# EAGLE schematic datalogger-v20 (EAGLE 7.7.0)
DATABASE: /Users/kina/Documents/eagle/PARTSDB.txt

## Sheet 1 of 2
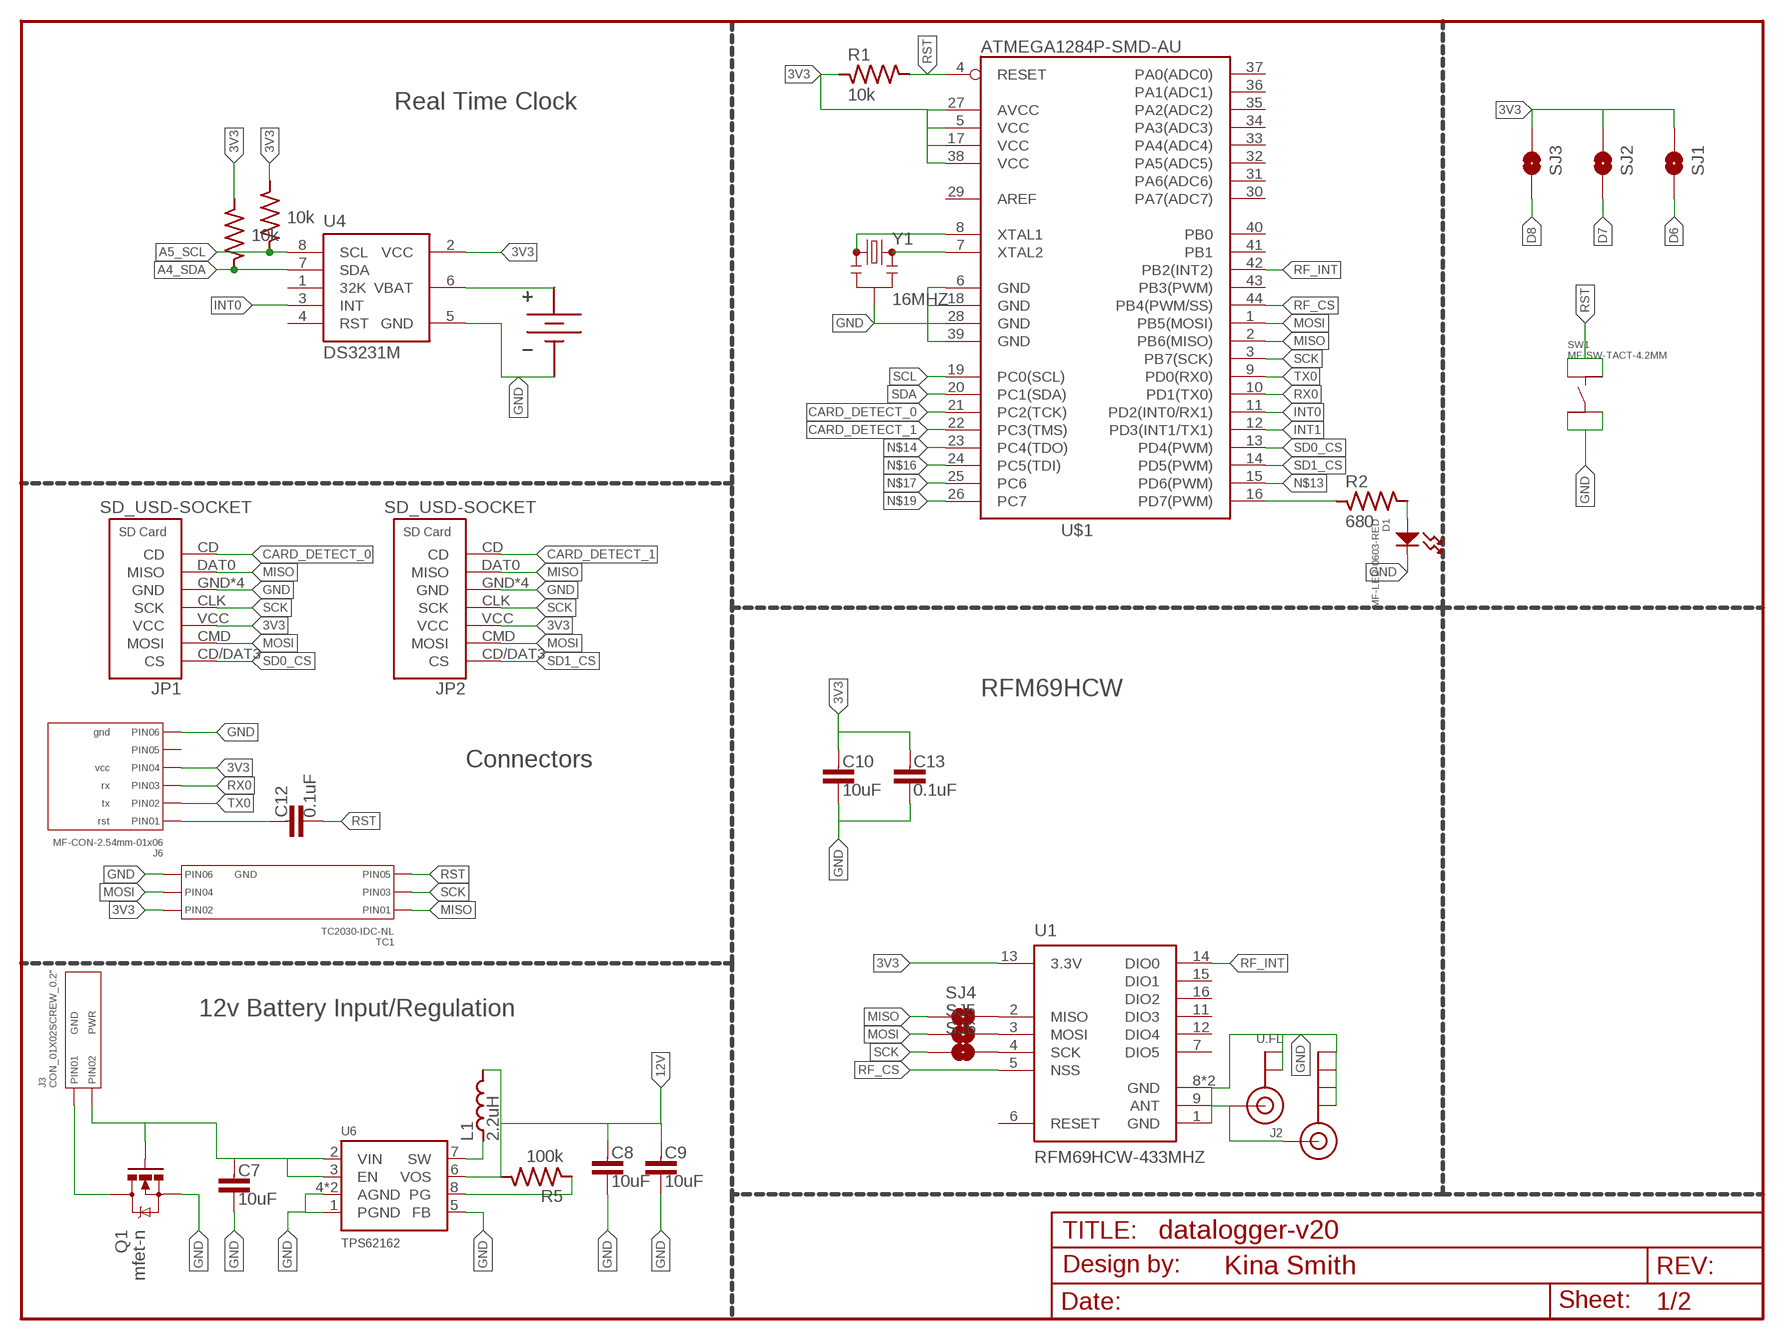
[diagram p0: schematic, sheet 1]

### Parts
BAT1  BATTERY_HOLDER12MM  [BAT_12MM]
C7  10uF  CAPACITOR_NP0805-N  [C0805-N]
C8  10uF  CAPACITOR_NP0805-N  [C0805-N]
C9  10uF  CAPACITOR_NP0805-N  [C0805-N]
C10  10uF  CAPACITOR_NP0805-N  [C0805-N]
C12  0.1uF  CAPACITOR_NP0603-N  [C0603-N]
C13  0.1uF  CAPACITOR_NP0603-N  [C0603-N]
D1  MF-LED-0603-RED  LED_SINGLE-0603-RED  [LED0603]
FRAME1  FRAME-LETTERNO_PACKAGE  [DUMMY]
J2  U.FL  ANTENNA_U.FL  [ADAFRUIT_U.FL]
J3  CON_01X02SCREW_0.2"  [SCREW_TERM_2POS]
J4  ANTENNA_SMA_EDGE  [SMA-EDGE]
J6  MF-CON-2.54mm-01x06  CON_01X06_PTH_2.54MM  [PTH_2.54MM_01X06]
JP1  SD_USD-SOCKET  [MICRO-SD-SOCKET-SDIO]
JP2  SD_USD-SOCKET  [MICRO-SD-SOCKET-SDIO]
L1  2.2uH  INDUCTOR2520  [L2520]
Q1  mfet-n  MOSFET-NCHANNELSOT23-3  [SOT23-3]
R1  10k  RESISTOR0603-N  [R0603-N]
R2  680  RESISTOR0603-N  [R0603-N]
R3  10k  RESISTOR0603-N  [R0603-N]
R4  10k  RESISTOR0603-N  [R0603-N]
R5  100k  RESISTOR0603-N  [R0603-N]
SJ1  JUMPER-PAD-2-NOYES_SILK  [PAD-JUMPER-2-NO_YES_SILK]
SJ2  JUMPER-PAD-2-NOYES_SILK  [PAD-JUMPER-2-NO_YES_SILK]
SJ3  JUMPER-PAD-2-NOYES_SILK  [PAD-JUMPER-2-NO_YES_SILK]
SJ4  JUMPER-PAD-2-NOYES_SILK  [PAD-JUMPER-2-NO_YES_SILK]
SJ5  JUMPER-PAD-2-NOYES_SILK  [PAD-JUMPER-2-NO_YES_SILK]
SJ6  JUMPER-PAD-2-NOYES_SILK  [PAD-JUMPER-2-NO_YES_SILK]
SW1  MF-SW-TACT-4.2MM  TACT_4.2MM  [TACT4.2MM]
TC1  TC2030-IDC-NL  CON_02X03_AVRISP_TC2030-IDC-NL  [TC2030-IDC-NL]
U1  RFM69HCW-433MHZ  [RFM69HCW-XXXS2]
U4  DS3231M  [SO08]
U6  TPS62162  [WSON-8]
U$1  ATMEGA1284P-SMD-AU  [TQFP44]
Y1  16MHZ  RESONATOR16MHZ  [RESONATOR-SMD]

### Nets
3V3: C10.1 C13.1 J6.P$4(PIN4) JP1.VCC JP2.VCC R1.1 R3.2 R4.2 SJ1.1 SJ2.1 SJ3.1 TC1.P$2(PIN2) U1.13(3.3V) U4.2(VCC) U$1.5(VCC) U$1.17(VCC) U$1.27(AVCC) U$1.38(VCC)
12V: C8.1 C9.1 L1.P$2 R5.2 U6.6(VOS)
A4_SDA: R4.1 U4.7(SDA)
A5_SCL: R3.1 U4.8(SCL)
ANT: J2.3(SIGNAL) J4.SIG(SIGNAL) U1.9(ANT)
CARD_DETECT_0: JP1.CD U$1.21(PC2(TCK))
CARD_DETECT_1: JP2.CD U$1.22(PC3(TMS))
D6: SJ1.2
D7: SJ2.2
D8: SJ3.2
GND [power]: BAT1.GND C7.2 C8.2 C9.2 C10.2 C13.2 D1.CATHODE J2.1(GND) J2.2(GND) J4.GND@0(GND) J4.GND@1(GND) J4.GND@2(GND) J4.GND@3(GND) J6.P$6(PIN6) JP1.GND JP1.GND1(GND) JP1.GND2(GND) JP1.GND3(GND) JP2.GND JP2.GND1(GND) JP2.GND2(GND) JP2.GND3(GND) Q1.2(S) SW1.P$3 SW1.P$4 TC1.P$6(PIN6) U1.1(GND) U1.8(GND) U1.10(GND) U4.5(GND) U6.1(PGND) U6.4(AGND) U6.5(FB) U6.P$9(AGND) U$1.6(GND) U$1.18(GND) U$1.28(GND) U$1.39(GND) Y1.2
INT0: U4.3(INT) U$1.11(PD2(INT0/RX1))
INT1: U$1.12(PD3(INT1/TX1))
MISO: JP1.DAT0(MISO) JP2.DAT0(MISO) SJ4.1 TC1.P$1(PIN1) U$1.2(PB6(MISO))
MOSI: JP1.CMD(MOSI) JP2.CMD(MOSI) SJ5.1 TC1.P$4(PIN4) U$1.1(PB5(MOSI))
N$1: J3.GND(PIN1) Q1.3(D)
N$2: R2.1 U$1.16(PD7(PWM))
N$3: U$1.7(XTAL2) Y1.3
N$4: C12.1 J6.P$1(PIN1)
N$5: U$1.8(XTAL1) Y1.1
N$6: L1.P$1 U6.7(SW)
N$7: SJ4.2 U1.2(MISO)
N$8: D1.ANODE R2.2
N$9: SJ5.2 U1.3(MOSI)
N$10: BAT1.PWR@1(VBAT) BAT1.PWR@2(VBAT) U4.6(VBAT)
N$13: U$1.15(PD6(PWM))
N$14: U$1.23(PC4(TDO))
N$15: SJ6.2 U1.4(SCK)
N$16: U$1.24(PC5(TDI))
N$17: U$1.25(PC6)
N$18: R5.1 U6.8(PG)
N$19: U$1.26(PC7)
RF_CS: U1.5(NSS) U$1.44(PB4(PWM/SS))
RF_INT: U1.14(DIO0) U$1.42(PB2(INT2))
RST: C12.2 R1.2 SW1.P$1 SW1.P$2 TC1.P$5(PIN5) U$1.4(RESET)
RX0: J6.P$3(PIN3) U$1.10(PD1(TX0))
SCK: JP1.CLK(SCK) JP2.CLK(SCK) SJ6.1 TC1.P$3(PIN3) U$1.3(PB7(SCK))
SCL: U$1.19(PC0(SCL))
SD0_CS: JP1.CD/DAT3(CS) U$1.13(PD4(PWM))
SD1_CS: JP2.CD/DAT3(CS) U$1.14(PD5(PWM))
SDA: U$1.20(PC1(SDA))
TX0: J6.P$2(PIN2) U$1.9(PD0(RX0))
V_BAT: C7.1 J3.PWR(PIN2) Q1.1(G) U6.2(VIN) U6.3(EN)
Unconnected: J6.P$5(PIN5) U1.6(RESET) U1.7(DIO5) U1.11(DIO3) U1.12(DIO4) U1.15(DIO1) U1.16(DIO2) U4.1(32K) U4.4(RST) U$1.29(AREF) U$1.30(PA7(ADC7)) U$1.31(PA6(ADC6)) U$1.32(PA5(ADC5)) U$1.33(PA4(ADC4)) U$1.34(PA3(ADC3)) U$1.35(PA2(ADC2)) U$1.36(PA1(ADC1)) U$1.37(PA0(ADC0)) U$1.40(PB0) U$1.41(PB1) U$1.43(PB3(PWM))

### Notes on the sheet
- Real Time Clock
- RFM69HCW
- Connectors
- 12v Battery Input/Regulation

## Sheet 2 of 2
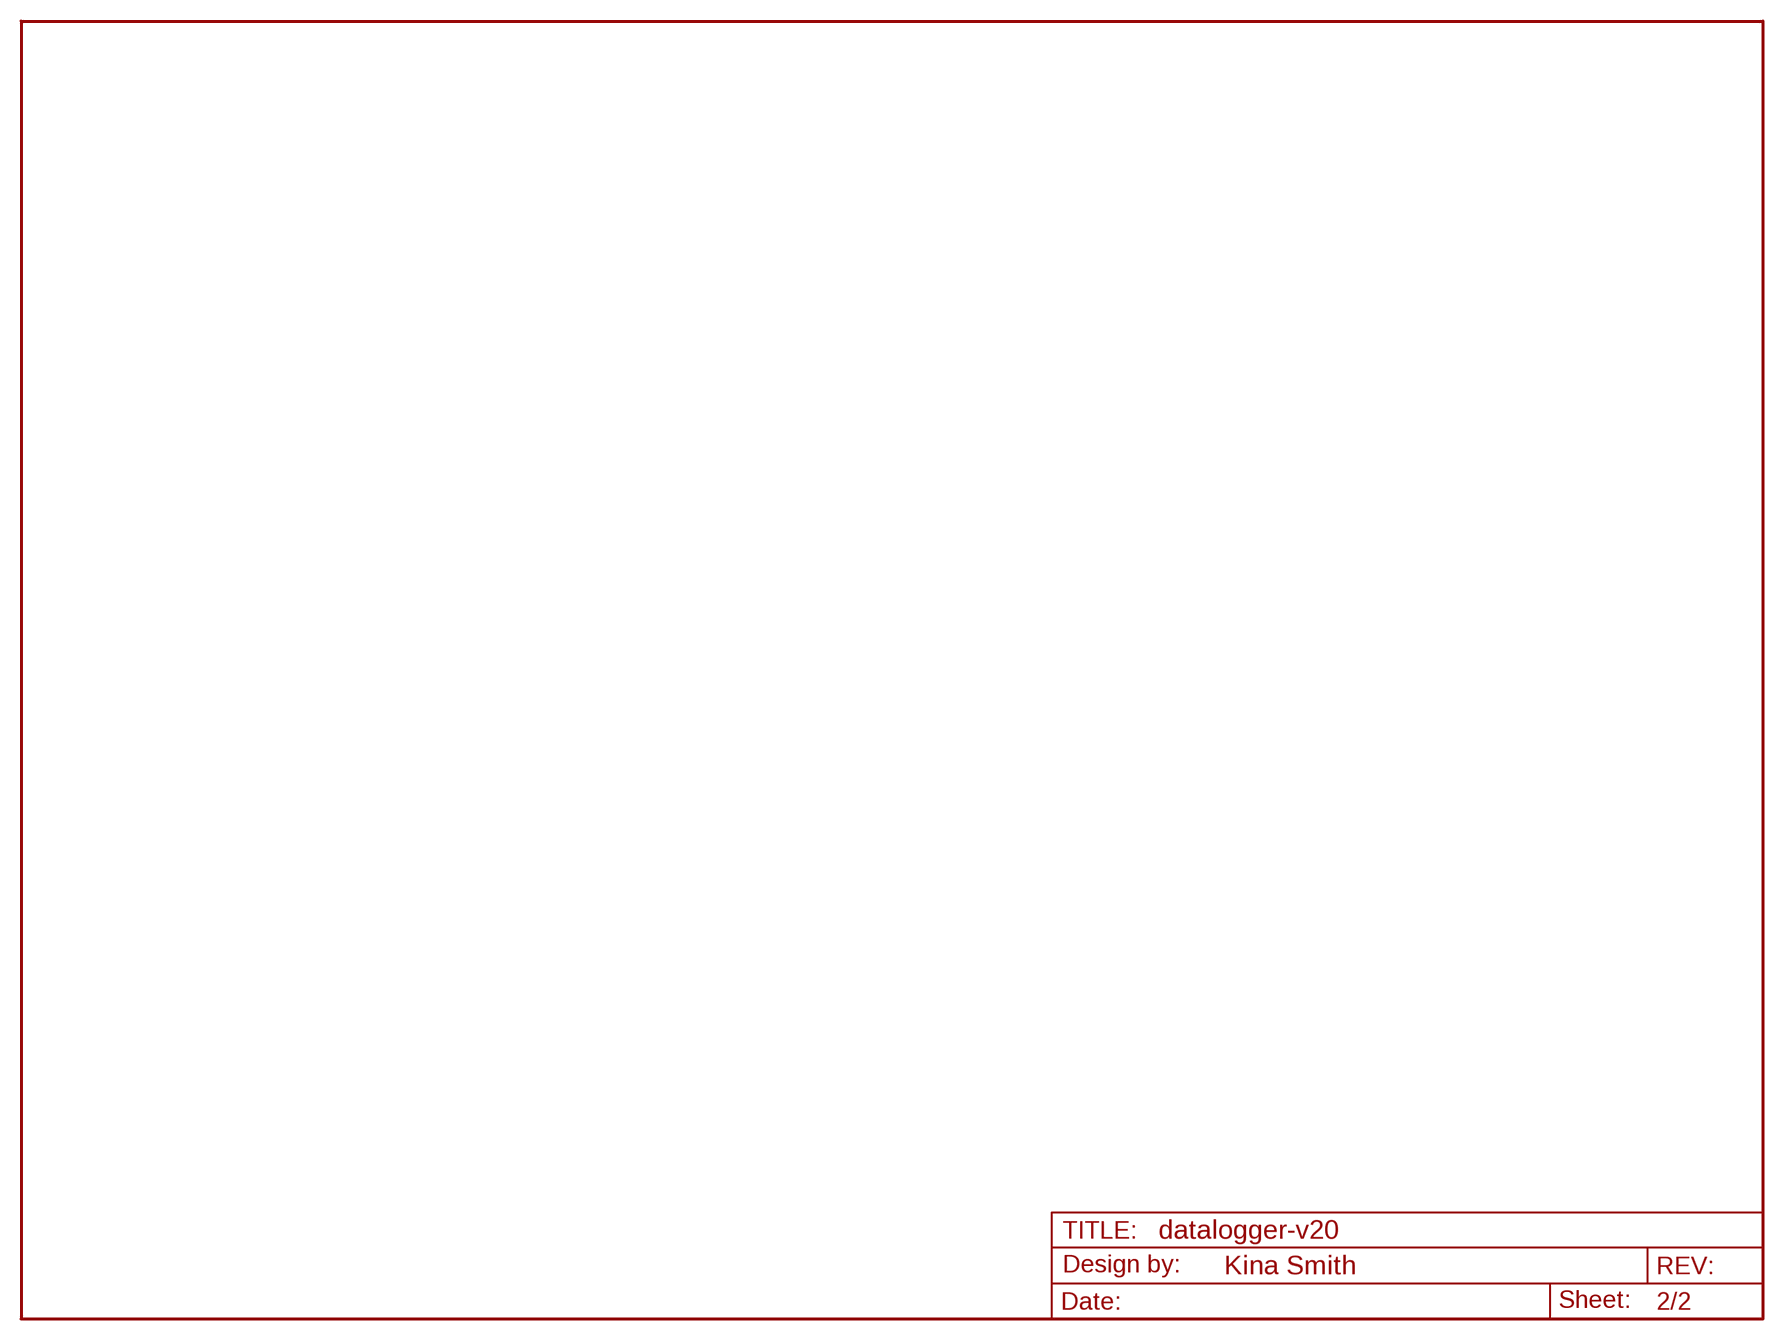
[diagram p1: schematic, sheet 2]

### Parts
FRAME3  FRAME-LETTERNO_PACKAGE  [DUMMY]

## Library data of the parts
BAT1 = My_Connectors:BATTERY_HOLDER; PARTNO: BK-885-TR
C7-C10 = My_Passives:CAPACITOR_NP; PARTNO: GRM21BR61C106KE15L
C12 C13 = My_Passives:CAPACITOR_NP; PARTNO: CC0603KRX7R7BB104
D1 = My_LEDs:LED_SINGLE: Library: MF_LEDs Description: Device for Single LED Packages. Manufacture part number (MFG#) can be added via Attributes.; HOUSEPART: YES; MPN: MF-LED-0603-RED; POPULATE: 1; URL: https://factory.macrofab.com/part/MF-LED-0603-RED
FRAME1 FRAME3 = _my-parts:FRAME-LETTER: Schematic Frame Standard 8.5x11 US Letter frame; DESIGNER: Nobody; VERSION: v01
J2 = My_Connectors:ANTENNA_U.FL: U.FL Antenna Connector; PARTNO: U.FL-R-SMT-1(10)
J3 = My_Connectors:CON_01X02: Library: MF_Connectors Description: Header Connector with 02 Positions and 01 Rows. Use the LABEL Attribute to label the pin on the schematic and PCB. You can remove the attributes on the PCB by using the SMASH function on the part and then deleting the text.; LABEL01: GND; LABEL02: PWR; PARTNO: 1729128
J4 = My_Connectors:ANTENNA_SMA_EDGE: SMA Antenna Connector End launch SMA connector. The paste layer has been removed so that the connector can be hand soldered onto the board after reflow.; PARTNO: EMPCB.SMAFSTJ.B.HT
J6 = My_Connectors:CON_01X06: Library: MF_Connectors Description: Header Connector with 6 Positions and 01 Rows. Use the LABEL Attribute to label the pin on the schematic and PCB. You can remove the attributes on the PCB by using the SMASH function on the part and then deleting the text.; HOUSEPART: YES; LABEL01: rst; LABEL02: tx; LABEL03: rx; LABEL04: vcc; LABEL06: gnd; MPN: MF-CON-2.54mm-01x06; PARTNO: NA; POPULATE: 1; URL: https://factory.macrofab.com/part/MF-CON-2.54mm-01x06
JP1 JP2 = My_Connectors:SD_USD-SOCKET: microSD Socket Push-push type uSD socket with full SDIO signal mapping. Spark Fun Electronics SKU : PRT-00127. tDoc lines correctly indicate media card edge positions when inserting (unlocked, locked, depressed). NOTE: CD1 and CD2 are connected internally, and short to ground when card is removed.; PARTNO: 101-00660-68-6; PROD_ID: CONN-07820
L1 = My_Passives:INDUCTOR; PARTNO: VLS252012T-2R2M1R3
Q1 = My_Descrete_Semiconductors:MOSFET-NCHANNEL: Common NMOSFET Parts MFG P/N Store ID Prod ID FDD8780 TRANS-09984 SI7820DN TRANS-11055 FDS6630A IC-08089 2N7002PW TRANS-11151 FQP30N06L COM-10213 TRANS-10060 BSS123LT1G TRANS-08345 BSS138 TRANS-00830 BS170 2N7000; PARTNO: SI2312BDS-T1-GE3
R1-R4 = My_Passives:RESISTOR; PARTNO: RC0603FR-0710KL
R5 = My_Passives:RESISTOR; PARTNO: RC0603FR-07100KL
SJ1-SJ6 = My_Passives:JUMPER-PAD-2-NO; PARTNO: NA
SW1 = My_ElectroMechanical:TACT: Library: MF_Switches Description: Device for Tact Switches. Manufacture part number (MFG#) can be added via Attributes.; HOUSEPART: YES; MPN: MF-SW-TACT-4.2MM; PARTNO: PTS810 SJM 250 SMTR LFS; POPULATE: 1; URL: https://factory.macrofab.com/part/MF-SW-TACT-4.2MM
TC1 = My_Connectors:CON_02X03: Library: MF_Connectors Description: Header Connector with 6 Positions and 02 Rows. Use the LABEL Attribute to label the pin on the schematic and PCB. You can remove the attributes on the PCB by using the SMASH function on the part and then deleting the text.; HOUSEPART: NO; LABEL06: GND; MPN: TC2030-IDC-NL; PARTNO: NA; POPULATE: 0; URL: http://www.tag-connect.com/AVRISP
U1 = My_RF:RFM69H; PARTNO: COM-13910; PROD_ID: IC-11997, IC-12053
U4 = My_IC_Digital:DS3231M: The DS3231M is a low-cost extremely accurate I2C realtime clock (RTC). Datasheet <https://datasheets.maximintegrated.com/en/ds/DS3231M.pdf>; PARTNO: DS3231MZ/V+
U6 = My_IC_Power:TPS62162; PARTNO: TPS62162DSGR
U$1 = My_IC_Digital:ATMEGA1284P-SMD
Y1 = My_xTal:RESONATOR: Resonator Small SMD resonator. Used, eg, on the Arduino Pro/ Pro Mini boards. 8MHz- XTAL-08895 16MHz- XTAL-08900; PROD_ID: XTAL-08900

## Net classes
1 power: width 0.381 mm, clearance 0.254 mm